# EAGLE schematic Ym2612 (EAGLE 9.6.2)
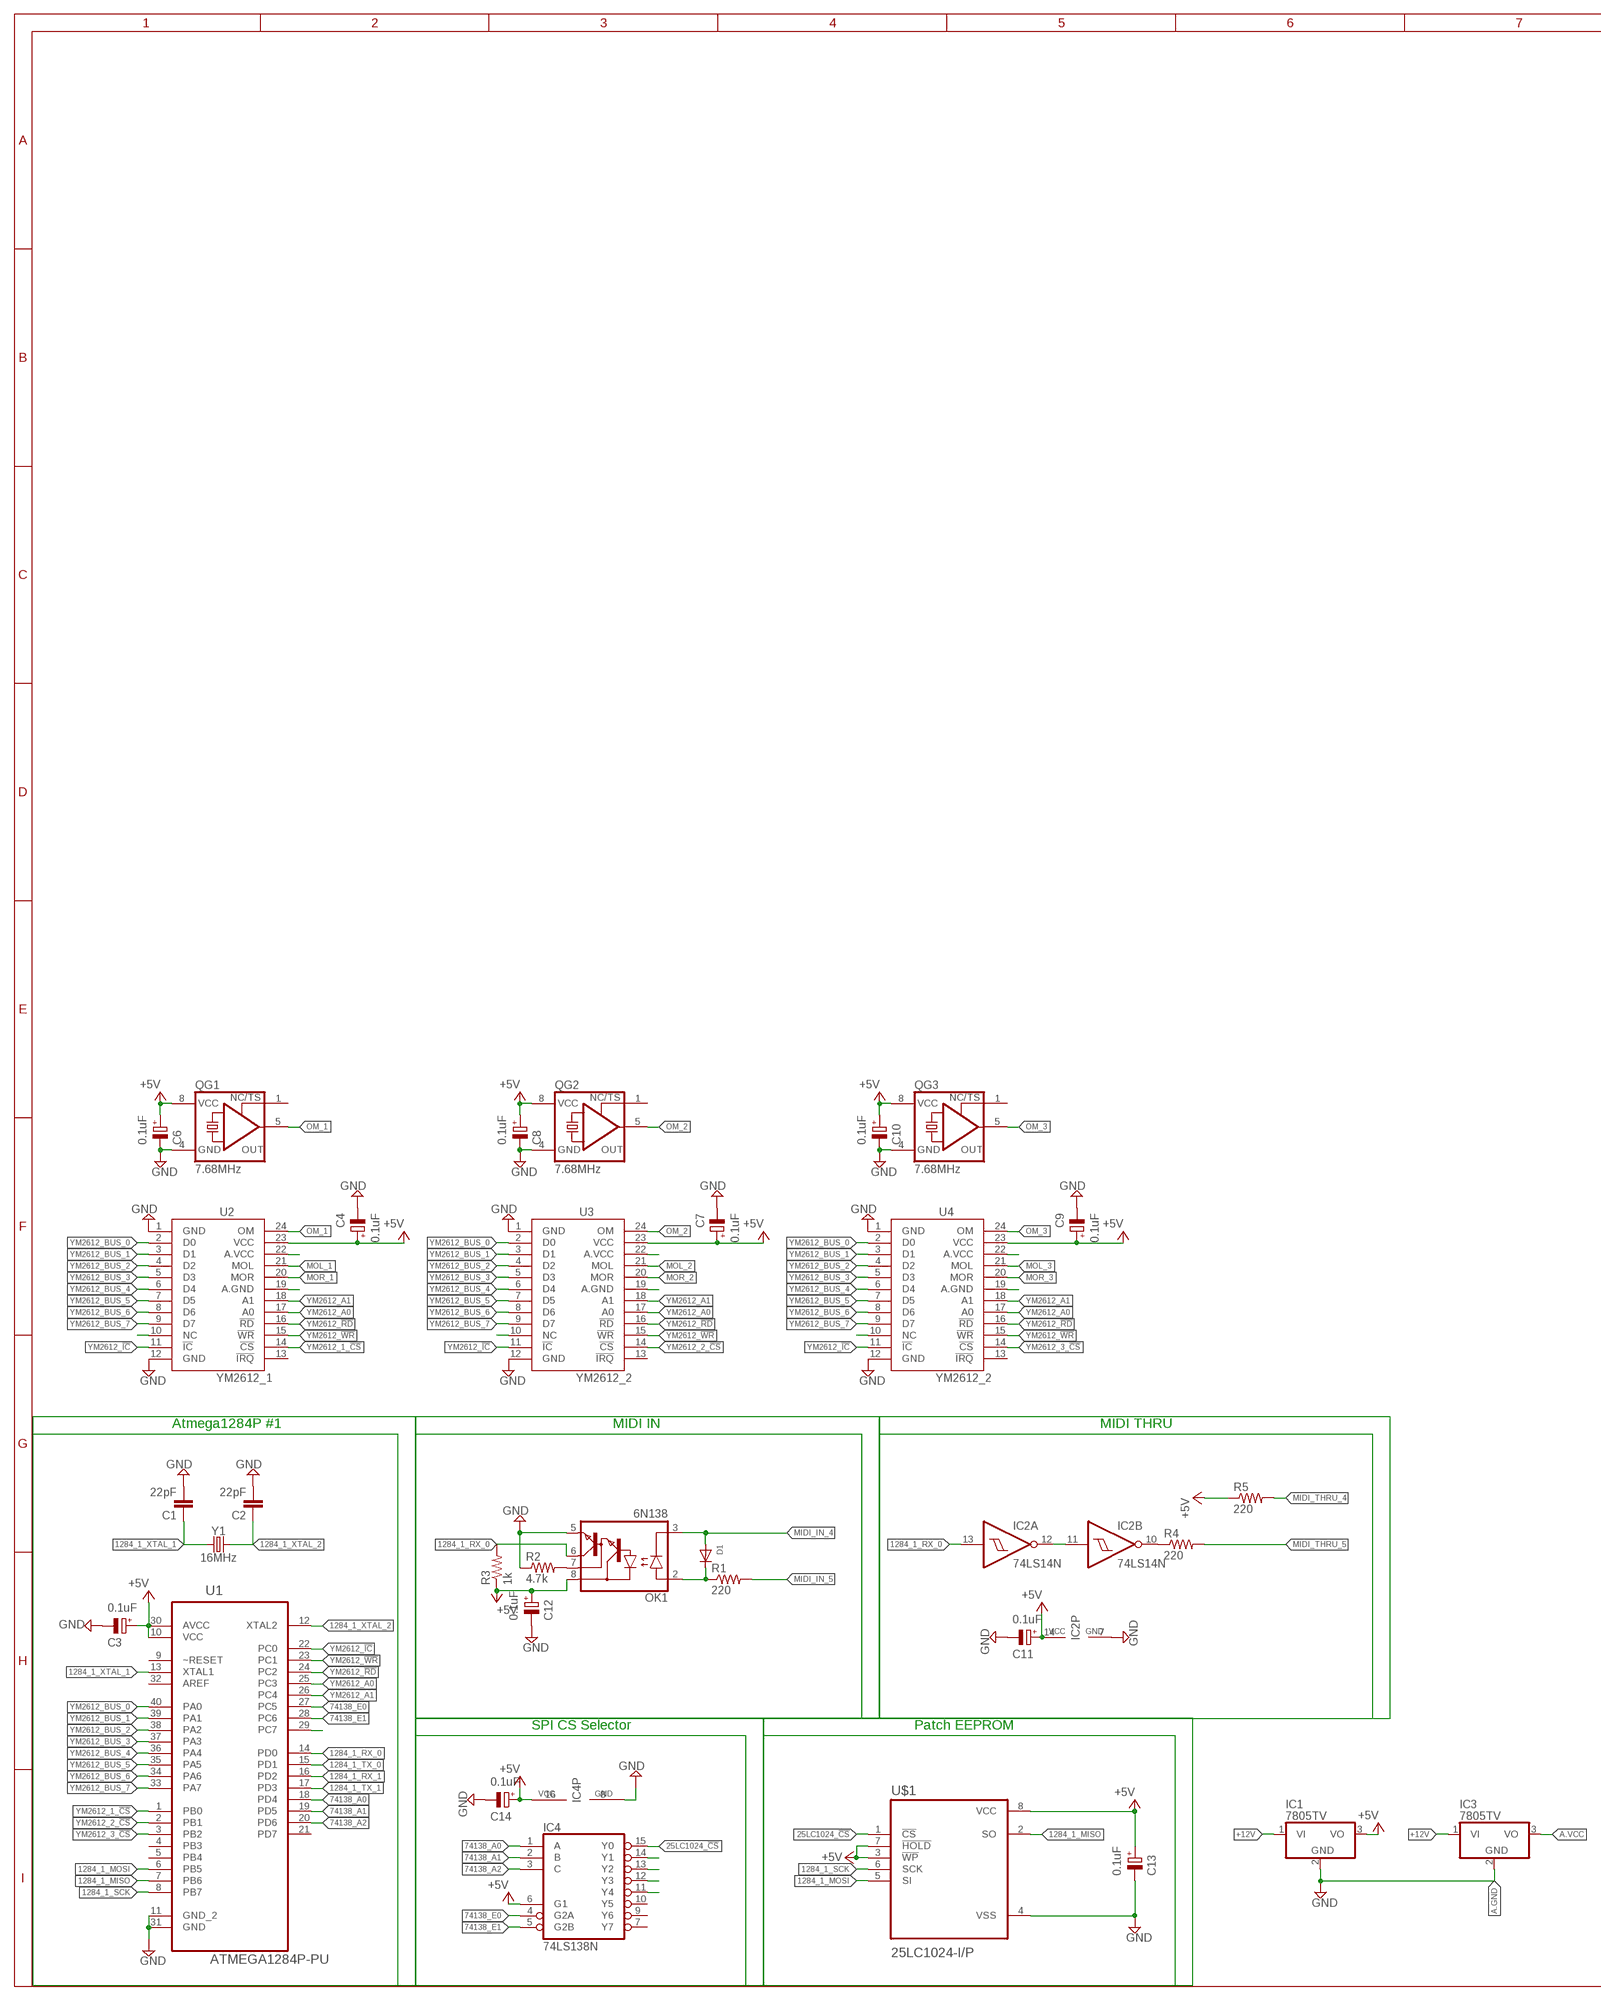
[diagram p0: schematic, sheet 1, part 1 of 2]
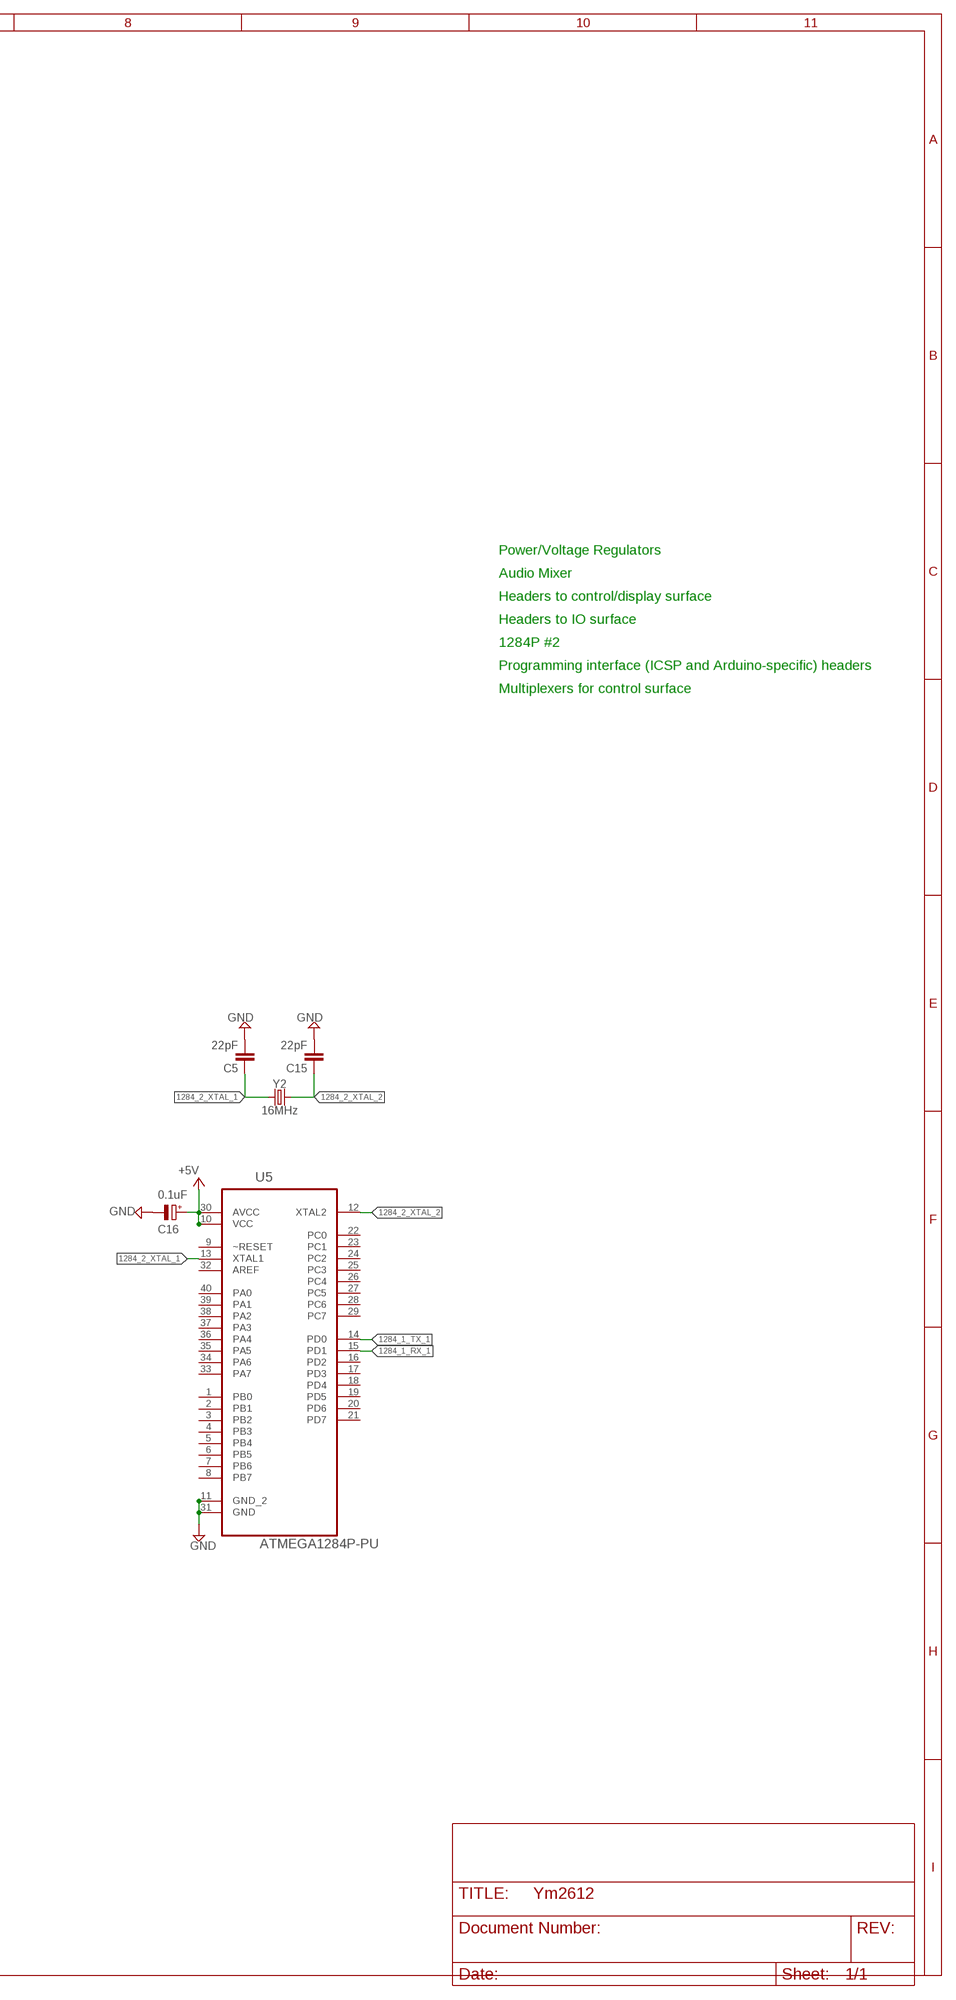
[diagram p1: schematic, sheet 1, part 2 of 2]

## Parts
C1  22pF  C-EU050-024X044  [C050-024X044]
C2  22pF  C-EU050-024X044  [C050-024X044]
C3  0.1uF  CPOL-EUE2.5-6  [E2,5-6]
C4  0.1uF  CPOL-EUE2.5-6  [E2,5-6]
C5  22pF  C-EU050-024X044  [C050-024X044]
C6  0.1uF  CPOL-EUE2.5-6  [E2,5-6]
C7  0.1uF  CPOL-EUE2.5-6  [E2,5-6]
C8  0.1uF  CPOL-EUE2.5-6  [E2,5-6]
C9  0.1uF  CPOL-EUE2.5-6  [E2,5-6]
C10  0.1uF  CPOL-EUE2.5-6  [E2,5-6]
C11  0.1uF  CPOL-EUE2.5-6  [E2,5-6]
C12  0.1uF  CPOL-EUE2.5-6  [E2,5-6]
C13  0.1uF  CPOL-EUE2.5-6  [E2,5-6]
C14  0.1uF  CPOL-EUE2.5-6  [E2,5-6]
C15  22pF  C-EU050-024X044  [C050-024X044]
C16  0.1uF  CPOL-EUE2.5-6  [E2,5-6]
D1  DIODEDO-1N4148  [DO-1N4148]
IC1  7805TV  [TO220V]
IC2  74LS14N  [DIL14]
IC3  7805TV  [TO220V]
IC4  74LS138N  [DIL16]
OK1  6N138  [DIL08]
QG1  7.68MHz  XO-8  [DIL08S]
QG2  7.68MHz  XO-8  [DIL08S]
QG3  7.68MHz  XO-8  [DIL08S]
R1  220  R-US_0207/10  [0207/10]
R2  4.7k  R-US_0207/10  [0207/10]
R3  1k  R-US_0207/10  [0207/10]
R4  220  R-US_0207/10  [0207/10]
R5  220  R-US_0207/10  [0207/10]
U1  ATMEGA1284P-PU  [DIP254P1524X483-40]
U2  YM2612_1  YM2612  [DIP24]
U3  YM2612_2  YM2612  [DIP24]
U4  YM2612_2  YM2612  [DIP24]
U5  ATMEGA1284P-PU  [DIP254P1524X483-40]
U$1  25LC1024-I/P  [DIP787W46P254L927H533Q8]
Y1  16MHz  CRYSTAL-16MHZPTH-HC49US  [HC49US]
Y2  16MHz  CRYSTAL-16MHZPTH-HC49US  [HC49US]

## Nets
25LC1024_!CS!: IC4.15(Y0) U$1.1(!CS)
1284_1_MISO: U1.7(PB6) U$1.2(SO)
1284_1_MOSI: U1.6(PB5) U$1.5(SI)
1284_1_RX_0: IC2.13(A:I) OK1.6(VO) R3.2 U1.14(PD0)
1284_1_RX_1: U1.16(PD2) U5.15(PD1)
1284_1_SCK: U1.8(PB7) U$1.6(SCK)
1284_1_TX_0: U1.15(PD1)
1284_1_TX_1: U1.17(PD3) U5.14(PD0)
1284_1_XTAL_1: C1.1 U1.13(XTAL1) Y1.1
1284_1_XTAL_2: C2.1 U1.12(XTAL2) Y1.2
1284_2_XTAL_1: C5.1 U5.13(XTAL1) Y2.1
1284_2_XTAL_2: C15.1 U5.12(XTAL2) Y2.2
74138_A0: IC4.1(A) U1.18(PD4)
74138_A1: IC4.2(B) U1.19(PD5)
74138_A2: IC4.3(C) U1.20(PD6)
74138_E0: IC4.4(G2A) U1.27(PC5)
74138_E1: IC4.5(G2B) U1.28(PC6)
+5V: C3.+ C4.+ C6.+ C7.+ C8.+ C9.+ C10.+ C11.+ C12.+ C13.+ C16.+ IC1.3(VO) IC2.14(P:VCC) IC4.6(G1) OK1.8(VCC) QG1.8(VCC) QG2.8(VCC) QG3.8(VCC) R3.1 R5.1 U1.10(VCC) U1.30(AVCC) U2.23(VCC) U3.23(VCC) U4.23(VCC) U5.10(VCC) U5.30(AVCC) U$1.3(!WP) U$1.7(!HOLD) U$1.8(VCC)
+12V: IC1.1(VI) IC3.1(VI)
A.GND: IC1.2(GND) IC3.2(GND) ; supply symbol labelled GND
A.VCC: IC3.3(VO)
GND: C1.2 C2.2 C3.- C4.- C5.2 C6.- C7.- C8.- C9.- C10.- C11.- C12.- C13.- C14.- C15.2 C16.- IC2.7(P:GND) IC4.8(GND) OK1.5(GND) QG1.4(GND) QG2.4(GND) QG3.4(GND) R2.1 U1.11(GND_2) U1.31(GND) U2.1(GND) U2.12(GND) U3.1(GND) U3.12(GND) U4.1(GND) U4.12(GND) U5.11(GND_2) U5.31(GND) U$1.4(VSS)
MIDI_IN_4: D1.A OK1.3(C)
MIDI_IN_5: R1.2
MIDI_THRU_4: R5.2
MIDI_THRU_5: R4.2
MOL_1: U2.21(MOL)
MOL_2: U3.21(MOL)
MOL_3: U4.21(MOL)
MOR_1: U2.20(MOR)
MOR_2: U3.20(MOR)
MOR_3: U4.20(MOR)
N$1: U3.10(NC)
N$2: U3.19(A.GND)
N$3: U3.22(A.VCC)
N$4: U4.10(NC)
N$5: U4.19(A.GND)
N$6: U2.19(A.GND)
N$7: U4.22(A.VCC)
N$8: IC2.10(B:O) R4.1
N$9: U2.10(NC)
N$10: U2.22(A.VCC)
N$11: D1.C OK1.2(A) R1.1
N$12: IC2.11(B:I) IC2.12(A:O)
N$13: OK1.7(VB) R2.2
N$18: U1.29(PC7)
N$22: IC4.14(Y1)
N$23: IC4.13(Y2)
N$24: IC4.12(Y3)
N$25: IC4.11(Y4)
N$26: C14.+ IC4.16(VCC) ; supply symbol labelled +5V
OM_1: QG1.5(OUT) U2.24(OM)
OM_2: QG2.5(OUT) U3.24(OM)
OM_3: QG3.5(OUT) U4.24(OM)
YM2612_1_!CS!: U1.1(PB0) U2.14(!CS!)
YM2612_2_!CS!: U1.2(PB1) U3.14(!CS!)
YM2612_3_!CS!: U1.3(PB2) U4.14(!CS!)
YM2612_!IC!: U1.22(PC0) U2.11(!IC!) U3.11(!IC!) U4.11(!IC!)
YM2612_!RD!: U1.24(PC2) U2.16(!RD!) U3.16(!RD!) U4.16(!RD!)
YM2612_!WR!: U1.23(PC1) U2.15(!WR!) U3.15(!WR!) U4.15(!WR!)
YM2612_A0: U1.25(PC3) U2.17(A0) U3.17(A0) U4.17(A0)
YM2612_A1: U1.26(PC4) U2.18(A1) U3.18(A1) U4.18(A1)
YM2612_BUS_0: U1.40(PA0) U2.2(D0) U3.2(D0) U4.2(D0)
YM2612_BUS_1: U1.39(PA1) U2.3(D1) U3.3(D1) U4.3(D1)
YM2612_BUS_2: U1.38(PA2) U2.4(D2) U3.4(D2) U4.4(D2)
YM2612_BUS_3: U1.37(PA3) U2.5(D3) U3.5(D3) U4.5(D3)
YM2612_BUS_4: U1.36(PA4) U2.6(D4) U3.6(D4) U4.6(D4)
YM2612_BUS_5: U1.35(PA5) U2.7(D5) U3.7(D5) U4.7(D5)
YM2612_BUS_6: U1.34(PA6) U2.8(D6) U3.8(D6) U4.8(D6)
YM2612_BUS_7: U1.33(PA7) U2.9(D7) U3.9(D7) U4.9(D7)
Unconnected: IC2.1(D:I) IC2.2(D:O) IC2.3(E:I) IC2.4(E:O) IC2.5(F:I) IC2.6(F:O) IC2.8(C:O) IC2.9(C:I) IC4.7(Y7) IC4.9(Y6) IC4.10(Y5) QG1.1(TS) QG2.1(TS) QG3.1(TS) U1.4(PB3) U1.5(PB4) U1.9(~RESET) U1.21(PD7) U1.32(AREF) U2.13(!IRQ!) U3.13(!IRQ!) U4.13(!IRQ!) U5.1(PB0) U5.2(PB1) U5.3(PB2) U5.4(PB3) U5.5(PB4) U5.6(PB5) U5.7(PB6) U5.8(PB7) U5.9(~RESET) U5.16(PD2) U5.17(PD3) U5.18(PD4) U5.19(PD5) U5.20(PD6) U5.21(PD7) U5.22(PC0) U5.23(PC1) U5.24(PC2) U5.25(PC3) U5.26(PC4) U5.27(PC5) U5.28(PC6) U5.29(PC7) U5.32(AREF) U5.33(PA7) U5.34(PA6) U5.35(PA5) U5.36(PA4) U5.37(PA3) U5.38(PA2) U5.39(PA1) U5.40(PA0)

## Notes on the sheet
- Power/Voltage Regulators
- Audio Mixer
- Headers to control/display surface
- Headers to IO surface
- 1284P #2
- Programming interface (ICSP and Arduino-specific) headers
- Multiplexers for control surface
- Atmega1284P #1 | MIDI IN | MIDI THRU
- SPI !CS! Selector | Patch EEPROM

## Library data of the parts
C1 C2 C5 C15 = rcl:C-EU: CAPACITOR, European symbol; SPICEPREFIX: C
C3 C4 C6-C14 C16 = rcl:CPOL-EU: POLARIZED CAPACITOR, European symbol; SPICEPREFIX: C
D1 = adafruit:DIODE: Diode SMADIODE - SMA Surface Mount Package 20V 1A Schottky Diode Digikey: 641-1014-6-ND DO-1N4148 - Through Hole Small Current Diode SOD-123 20V 1 A (.5mV Vf) Schottky Diode - Digikey: MBRX120TPMSCT-ND SOD-323 10V 570mA (.38mV Vf, 3ns) Schottky Diode - Digikey: ZLLS410CT-ND SOD-523 30V 30mA Schottky Diode (RB751S-40TE61) - Digikey: RB751S-40TE61CT-ND SOT23-R/W - SOT23 Package (R = Solder Paste/Reflow Ovens, W = Hand-Soldering) BAT54Film 40V 300mA - Digikey: 497-7162-1-ND
IC1 IC3 = linear:78*: Positive VOLTAGE REGULATOR Source: http://cache.national.com/ds/LM/LM78L05.pdf http://www.fairchildsemi.com/ds/LM/LM7805.pdf
IC2 = 74xx-eu:74*14: Hex schmitt trigger INVERTER
IC4 = 74xx-us:74*138: 3-line to 8-line DECODER/DEMULTIPLEXER
OK1 = optocoupler:6N138: MOTOROLA OPTO COUPLER; MF: VISHAY/TELEFUNKEN; MPN: 6N138; OC_FARNELL: 9860150; OC_NEWARK: 35K5294
QG1-QG3 = crystal:XO-: CRYSTAL; OC_FARNELL: unknown; OC_NEWARK: unknown
R1-R5 = rcl:R-US_: RESISTOR, American symbol; SPICEPREFIX: R
U1 U5 = ATMEGA1284P-PU:ATMEGA1284P-PU: 8-bit Microcontroller with In-System Programmable Flash; AVAILABILITY: Unavailable; DESCRIPTION: AVR AVR® ATmega Microcontroller IC 8-Bit 20MHz 128KB (64K x 16) FLASH 40-PDIP; DIGIKEY-PURCHASE-URL: https://snapeda.com/shop?store=DigiKey&id=666032; MF: Microchip; MP: ATMEGA1284P-PU; PACKAGE: PDIP-40 Microchip; PRICE: None
U2-U4 = YM2612:YM2612: YM2612 - Yamaha FM Synthesis IC
U$1 = 25LC1024-I_P:25LC1024-I/P; AVAILABILITY: Unavailable; DESCRIPTION: EEPROM Memory IC 1Mb (128K x 8) SPI 20MHz 8-PDIP; MF: Microchip; MP: 25LC1024-I/P; PACKAGE: DIP-8 Microchip; PRICE: None
Y1 Y2 = SparkFun-Clocks:CRYSTAL-16MHZ: 16MHz Crystal Digikey Example <http://www.digikey.com/product-search/en?keywords=535-9122-1-ND> Frequency: 16MHz Frequency Stability: ±50ppm Frequency Tolerance: ±20ppm Load Capacitance: 18pF SparkFun Products: Pro Micro -5V/16MHz <https://www.sparkfun.com/products/12640> SparkFun Serial Enabled LCD Kit <https://www.sparkfun.com/products/10097>; PROD_ID: XTAL-08181; SF_ID: COM-00536